# EAGLE design 20191202_GantryGripper_EA (EAGLE 9.5.1)
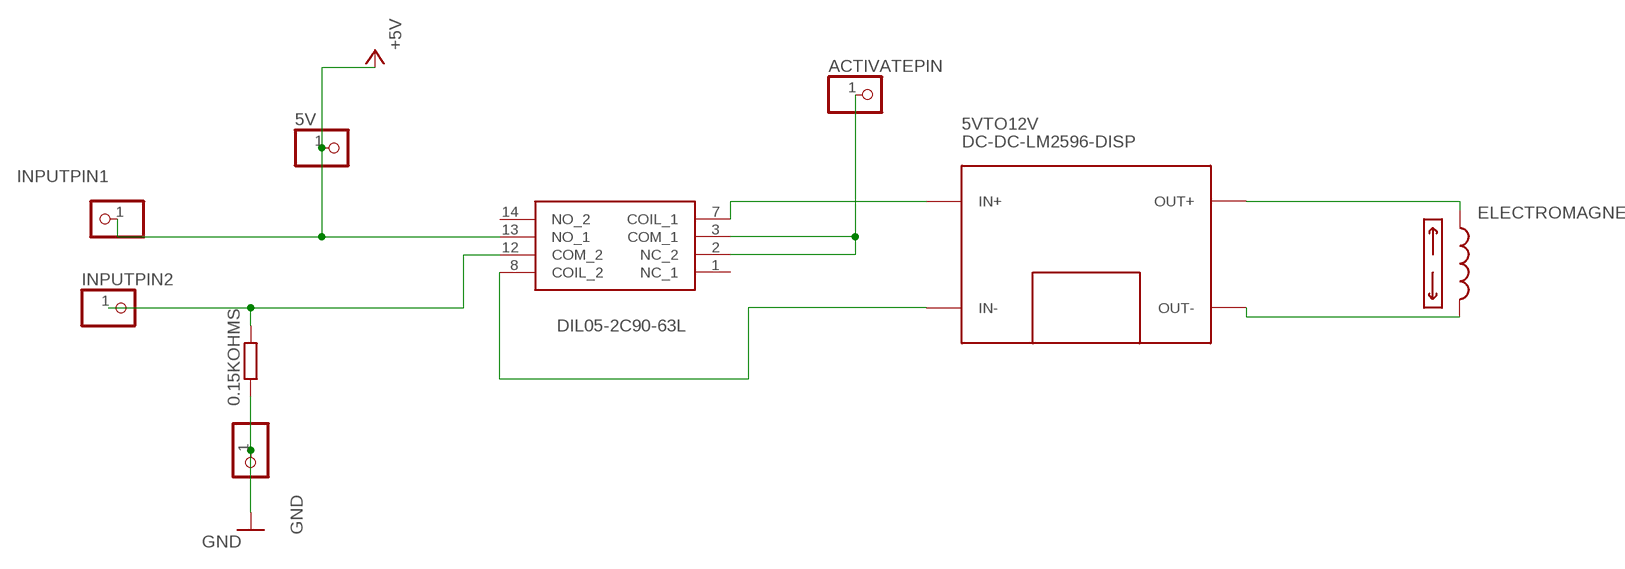
[diagram p0: schematic, sheet 1]

## Parts
0.15KOHMS  R-EU_0204/2V  [0204V]
5V  PINHD-1X1  [1X01]
5VTO12V  DC-DC-LM2596-DISP  [DC-DC-LM2596-DISP]
ACTIVATEPIN  PINHD-1X1  [1X01]
ELECTROMAGNET  SOLENOID  [1X02]
GND  PINHD-1X1  [1X01]
INPUTPIN1  PINHD-1X1  [1X01]
INPUTPIN2  PINHD-1X1  [1X01]
K1  DIL05-2C90-63L  [DIL052C9063L]

## Nets
+5V: 5V.1 INPUTPIN1.1 K1.13(NO_1)
GND: 0.15KOHMS.1 GND.1
N$1: 5VTO12V.IN+ K1.7(COIL_1)
N$2: 5VTO12V.IN- K1.8(COIL_2)
N$3: ACTIVATEPIN.1 K1.2(NC_2) K1.3(COM_1)
N$4: 0.15KOHMS.2 INPUTPIN2.1 K1.12(COM_2)
N$5: 5VTO12V.OUT+ ELECTROMAGNET.1
N$6: 5VTO12V.OUT- ELECTROMAGNET.2
Unconnected: K1.1(NC_1) K1.14(NO_2)

## Library data of the parts
0.15KOHMS = rcl:R-EU_: RESISTOR, European symbol; SPICEPREFIX: R
5V ACTIVATEPIN GND INPUTPIN1 INPUTPIN2 = pinhead:PINHD-1X1: PIN HEADER
5VTO12V = diy-modules:DC-DC-LM2596-DISP: DC/DC Step-Down Regulator with Voltage Display based on LM2596-ADJ chip More details available here: http://www.instructables.com/id/The-Introduction-of-LM2596-Step-Down-Power-Module-/ LM2596 datasheet available here: http://www.ti.com/lit/ds/symlink/lm2596.pdf Click here to find device on ebay.com <http://www.ebay.com/sch/lm2596+led+voltmeter+40>
ELECTROMAGNET = my_mixed:SOLENOID
K1 = SamacSys_Parts:DIL05-2C90-63L: DPDT Reed Relay, 5V dc Source: Datasheet <https://componentsearchengine.com/Datasheets/1/DIL05-2C90-63L.pdf>; DESCRIPTION: DPDT Reed Relay, 5V dc; HEIGHT: 10mm; MANUFACTURER_NAME: Meder; MANUFACTURER_PART_NUMBER: DIL05-2C90-63L; MOUSER_PART_NUMBER: 876-DIL05-2C90-63L; MOUSER_PRICE-STOCK: https://www.mouser.com/Search/Refine.aspx?Keyword=876-DIL05-2C90-63L

## Board
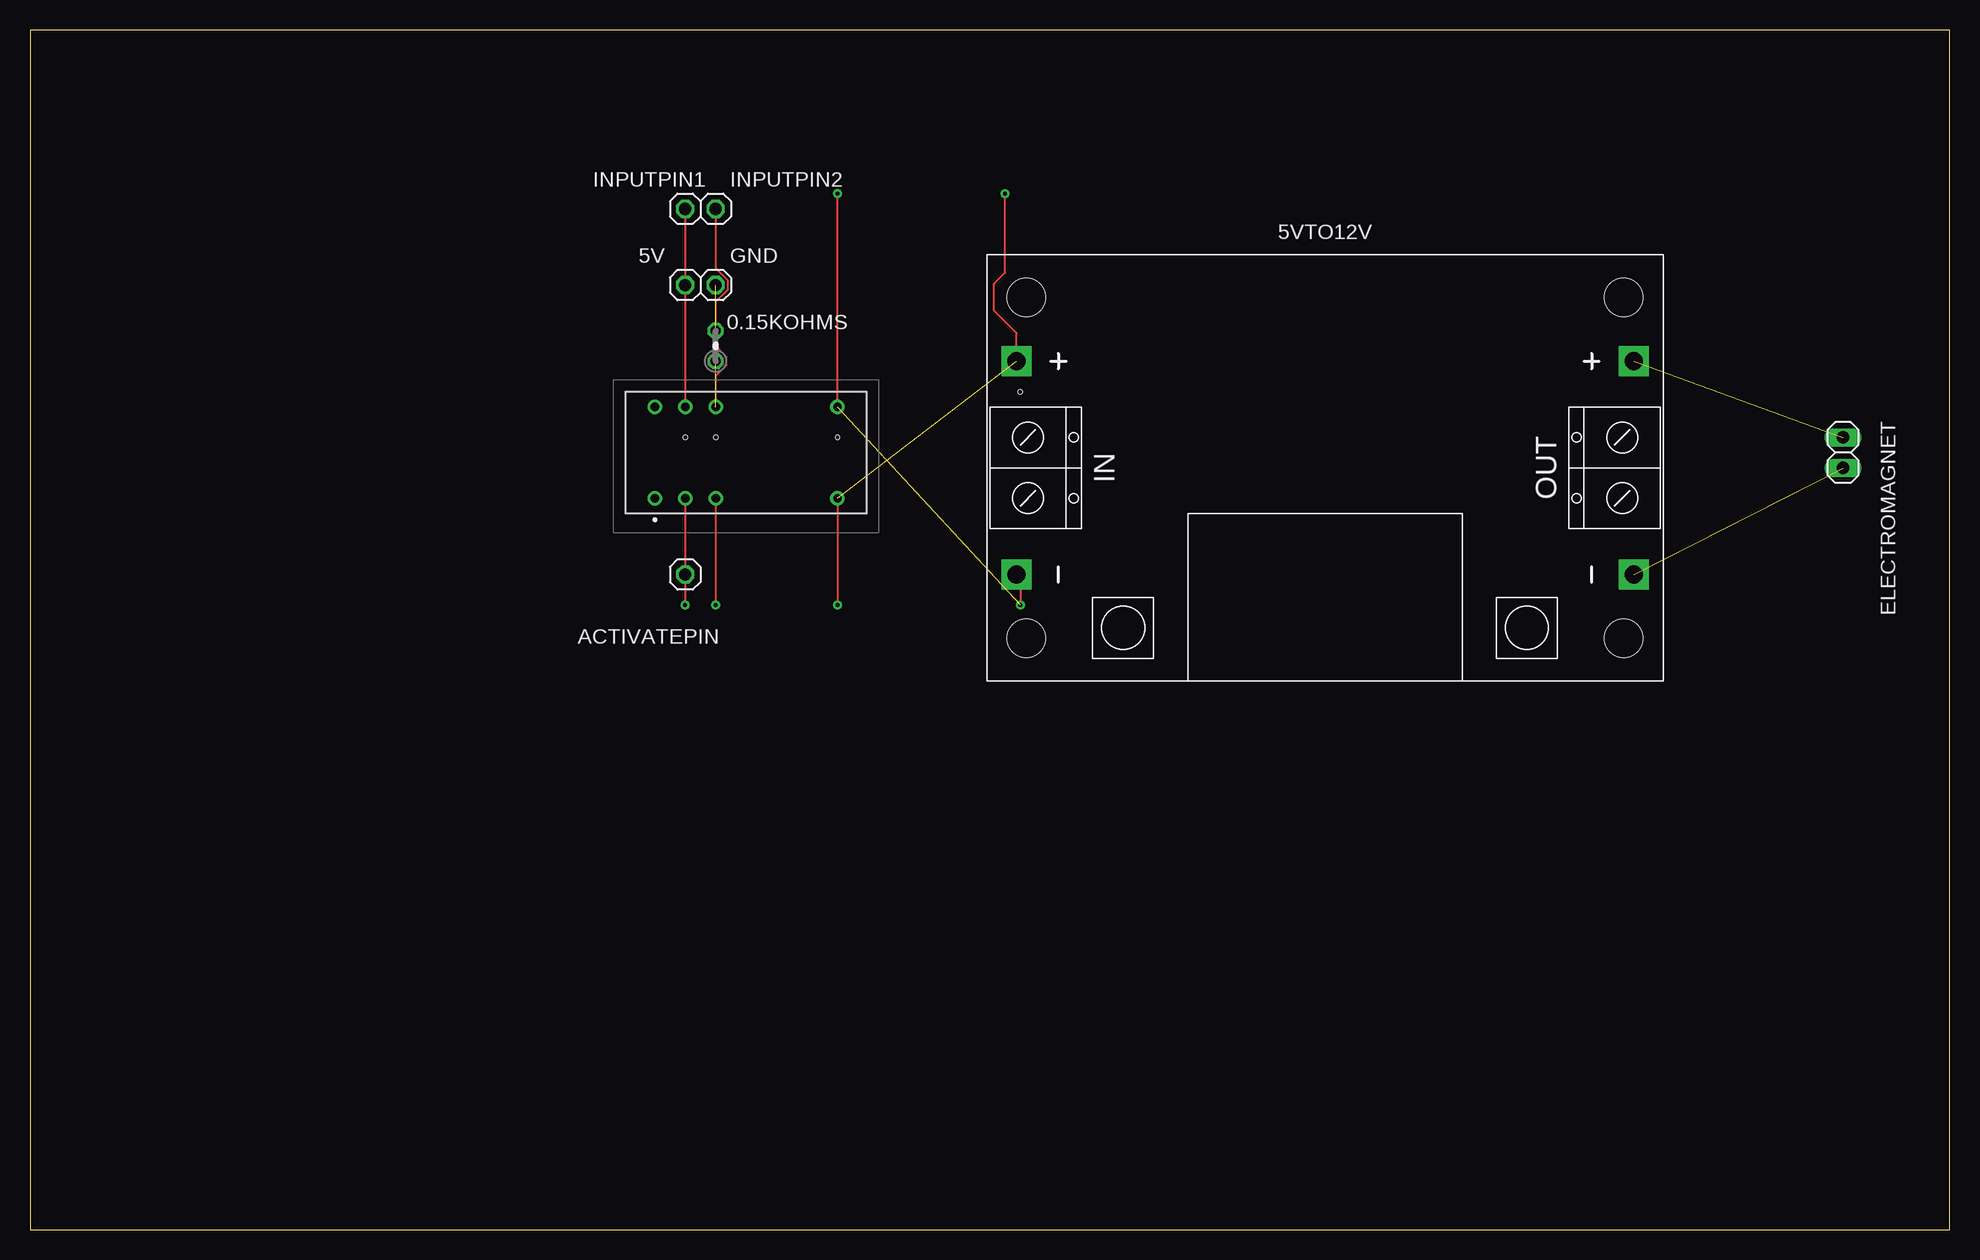
[diagram p1: board, top side]
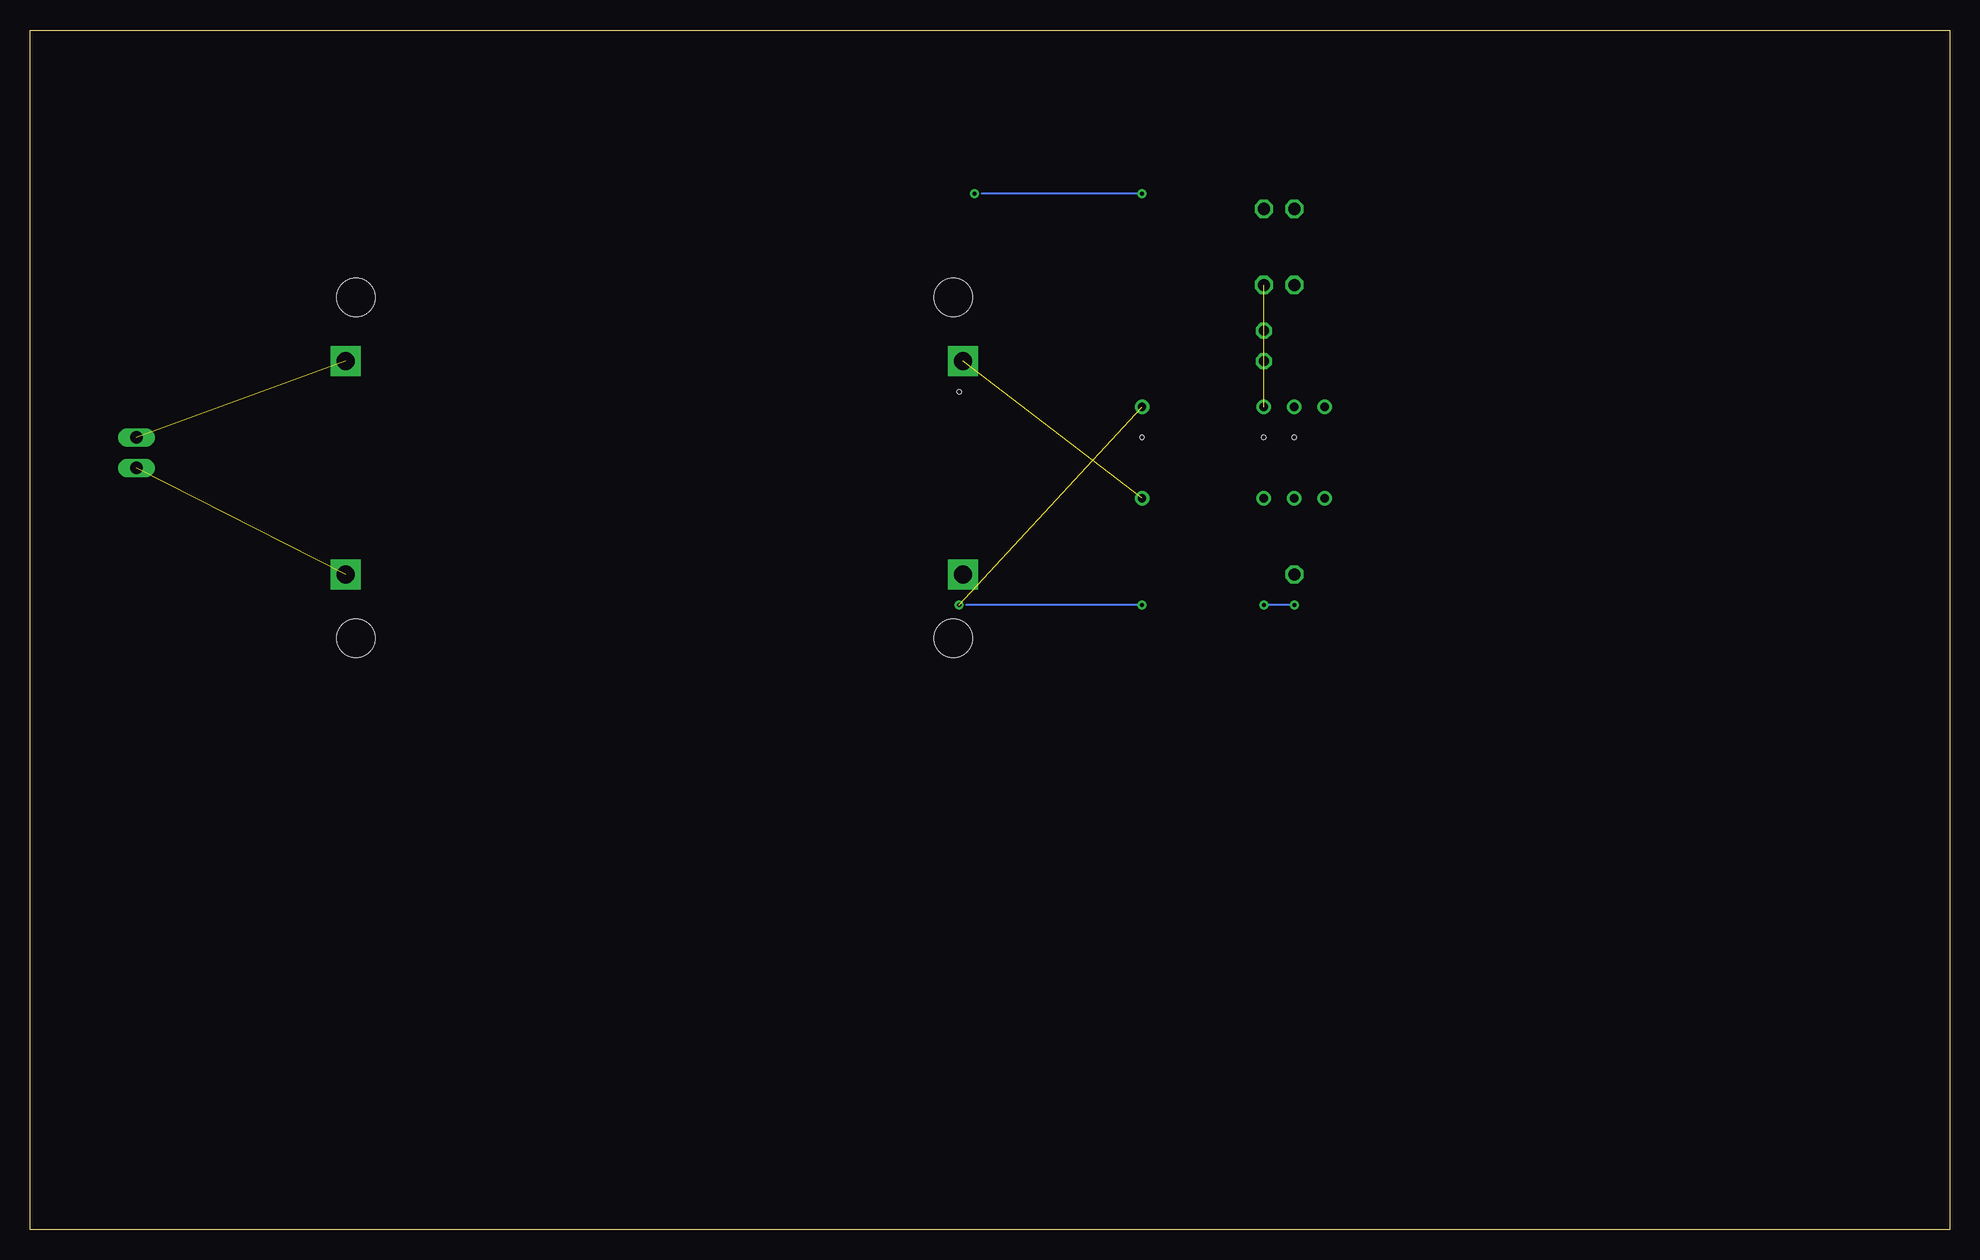
[diagram p2: board, bottom side, seen from below]

Size 160 x 100 mm. Coordinates in mm from the lower left corner, seen from the top.
Outline: 0,0 160,0 160,100 0,100 0,0
Copper layers (1*16): Top 0.035mm / dielectric 1.5mm / Bottom 0.035mm
Design rules "default": minimum track width 6mil, minimum drill 0.35mm, track to track 6mil, track to pad 6mil, pad to pad 6mil, via to via 6mil, smd to smd 6mil, copper to edge 40mil, drill to drill 6mil, minimum pad ring 10mil, minimum via ring 8mil, stop-mask expansion 4mil, vias tented up to drill 0mil, thermal gap 10mil
Holes 0.35 mm at 54.61,66.04 57.15,66.04 67.31,66.04 82.55,69.85

### Footprints (pad centres in the part's own frame; a part is rotated, then mirrored left to right if it is on the bottom)
0204V = drill 0.813 octagon: 1 -1.27,0; 2 1.27,0
1X01 = drill 1.016 octagon: 1 0,0
DC-DC-LM2596-DISP = drill 1.5 pad 2.5 square: IN+ -25.718,8.89; IN- -25.718,-8.89; OUT+ 25.718,8.89; OUT- 25.718,-8.89 | hole 3.2: -24.892,14.224; 24.892,-14.224; 24.892,14.224; -24.892,-14.224
1X02 = drill 1.016 long: 1 -1.27,0; 2 1.27,0
DIL052C9063L = drill 0.7 pad 1.2: 1 -7.62,-3.81; 2 -5.08,-3.81; 3 -2.54,-3.81; 7 7.62,-3.81; 8 7.62,3.81; 12 -2.54,3.81; 13 -5.08,3.81; 14 -7.62,3.81

### Placement (x,y rotation side)
0.15KOHMS  57.15,73.66 90 top
5V  54.61,78.74 0 top
5VTO12V  107.95,63.5 0 top
ACTIVATEPIN  54.61,54.61 0 top
ELECTROMAGNET  151.13,64.77 270 top
GND  57.15,78.74 0 top
INPUTPIN1  54.61,85.09 0 top
INPUTPIN2  57.15,85.09 0 top
K1  59.69,64.77 0 top

### Tracks (layer width: path | path; a pad name or v marks a point on that pad's centre or on a via)
+5V
  Top 0.152: K1.13 5V.1 INPUTPIN1.1
GND  (1 unrouted)
N$1  (via drill 0.35)  (1 unrouted)
  Top 0.152: 5VTO12V.IN+ 82.23,74.74 80.37,76.61 80.37,78.84 81.28,79.75 v81.28,86.36 | K1.7 v67.31,52.07
  Bottom 0.152: v67.31,52.07 81.94,52.07
N$2  (via drill 0.35)  (1 unrouted)
  Top 0.152: K1.8 v67.31,86.36 | 5VTO12V.IN- 82.55,54.29 v82.55,52.07
  Bottom 0.152: v67.31,86.36 80.67,86.36
N$3  (via drill 0.35)
  Top 0.152: K1.2 ACTIVATEPIN.1 v54.61,52.07 | K1.3 v57.15,52.07
  Bottom 0.152: v54.61,52.07 v57.15,52.07
N$4  (1 unrouted)
  Top 0.152: INPUTPIN2.1 57.15,80.14 58.14,79.15 58.14,78.33 57.15,77.34 57.15,73.65 58.04,72.76 58.04,72.02 57.15,71.13 K1.12
N$5  (1 unrouted)
N$6  (1 unrouted)